# EAGLE design switch_eval_box_redo_v2-1 (EAGLE 9.6.2)
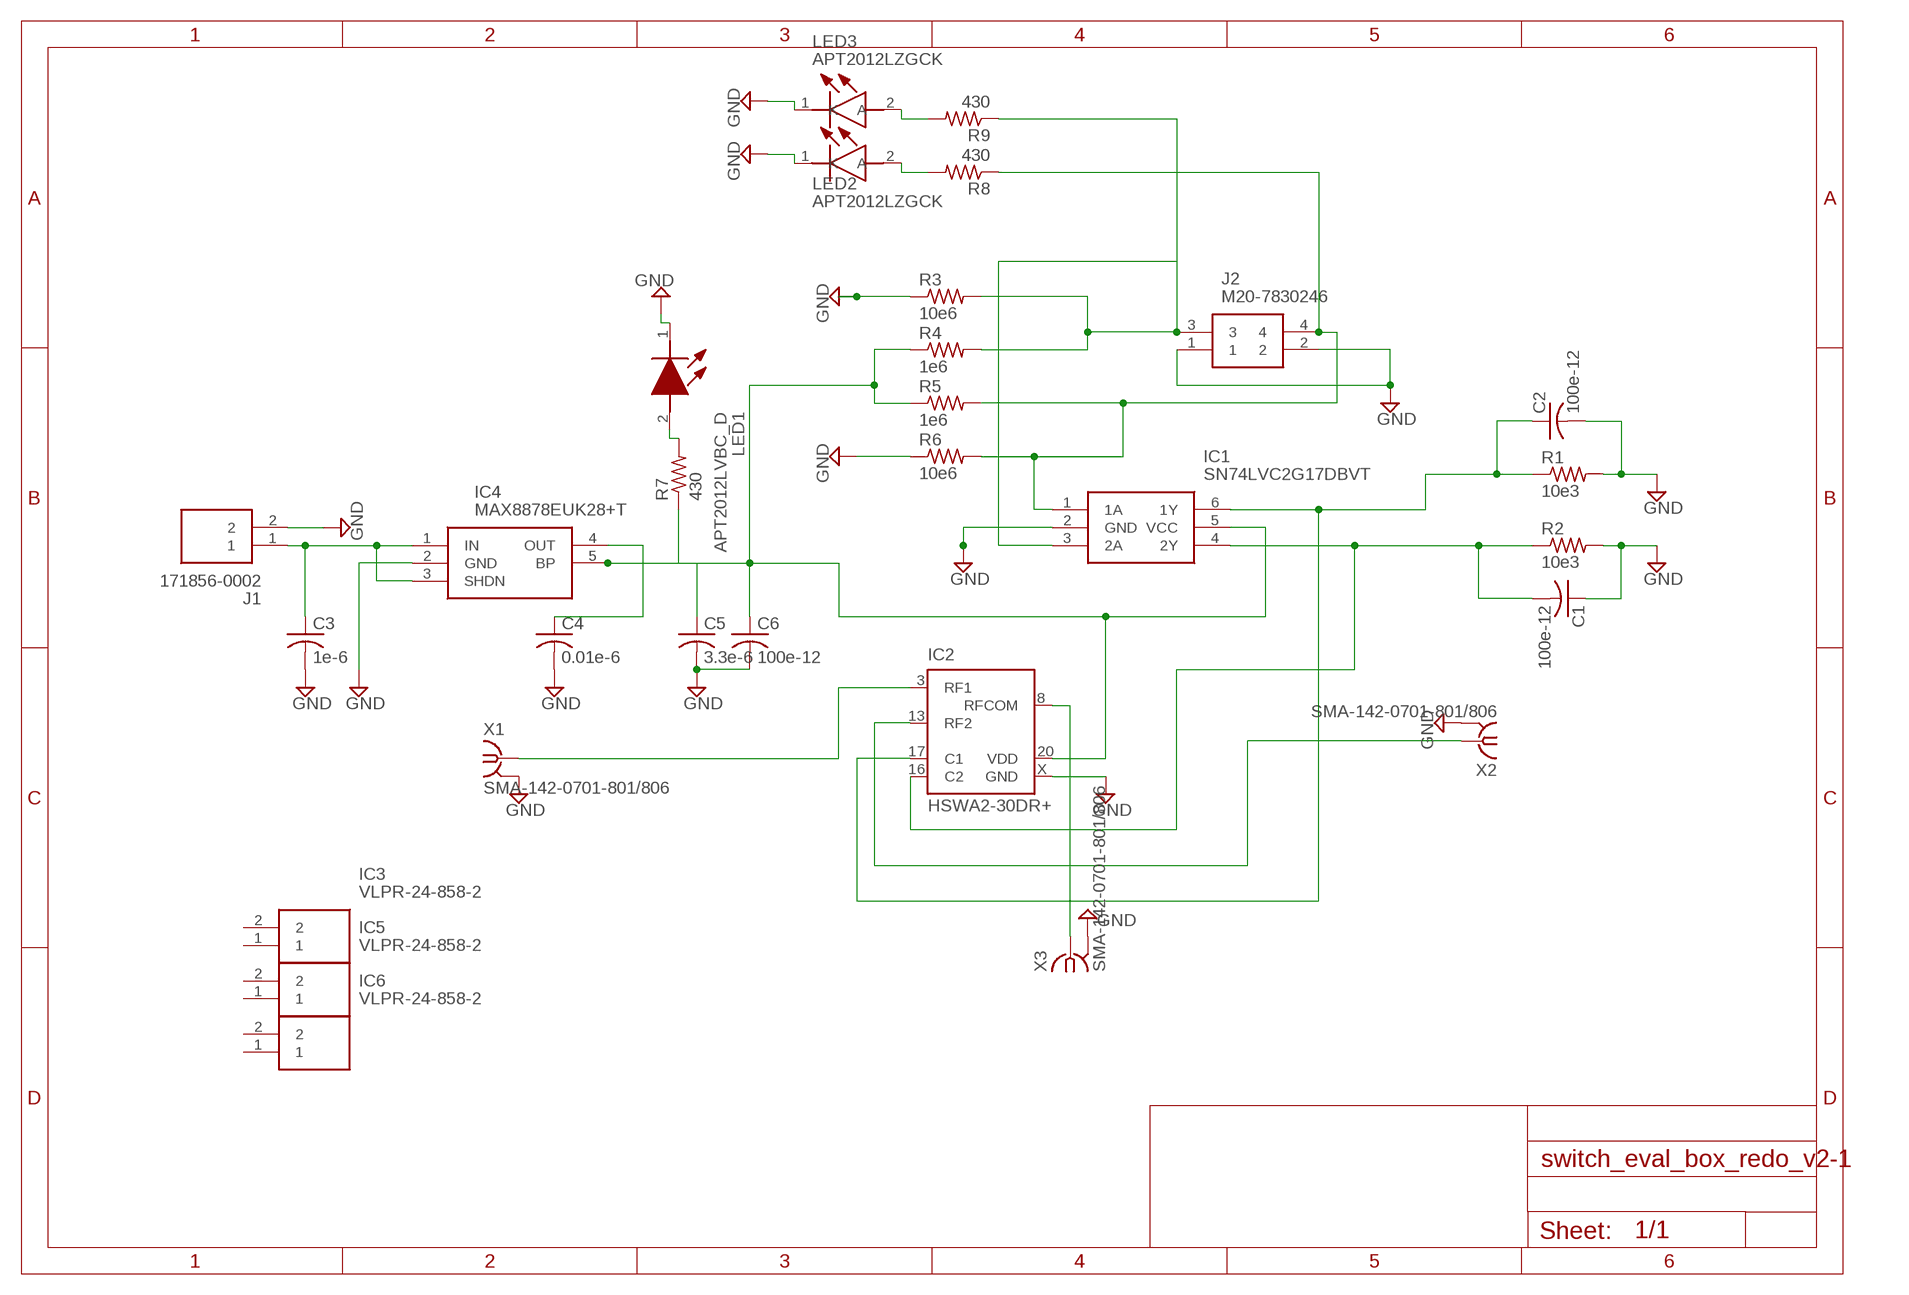
[diagram p0: schematic, sheet 1]

## Parts
C1  100e-12  C-USC0603  [C0603]
C2  100e-12  C-USC0603  [C0603]
C3  1e-6  C-USC0603  [C0603]
C4  0.01e-6  C-USC0603  [C0603]
C5  3.3e-6  C-USC0603  [C0603]
C6  100e-12  C-USC0603  [C0603]
IC1  SN74LVC2G17DBVT  [SOT95P280X145-6N]
IC2  HSWA2-30DR+  [DG983-1]
IC3  VLPR-24-858-2  [VLPR248582]
IC4  MAX8878EUK28+T  [SOT95P280X145-5N]
IC5  VLPR-24-858-2  [VLPR248582]
IC6  VLPR-24-858-2  [VLPR248582]
J1  171856-0002  [SHDR2W90P0X254_1X2_493X635X106]
J2  M20-7830246  [M207830246]
LED1  APT2012LVBC_D  [LEDC2012X85N]
LED2  APT2012LZGCK  [LEDC2012X85N]
LED3  APT2012LZGCK  [LEDC2012X85N]
R1  10e3  R-US_R0603  [R0603]
R2  10e3  R-US_R0603  [R0603]
R3  10e6  R-US_R0603  [R0603]
R4  1e6  R-US_R0603  [R0603]
R5  1e6  R-US_R0603  [R0603]
R6  10e6  R-US_R0603  [R0603]
R7  430  R-US_R0603  [R0603]
R8  430  R-US_R0603  [R0603]
R9  430  R-US_R0603  [R0603]
X1  SMA-142-0701-801/806  [J502-ND-142-0701-801/806]
X2  SMA-142-0701-801/806  [J502-ND-142-0701-801/806]
X3  SMA-142-0701-801/806  [J502-ND-142-0701-801/806]

## Nets
GND: C1.1 C2.2 C3.2 C4.2 C5.2 C6.2 IC1.2(GND) IC2.X(GND) IC4.2(GND) J1.2 J2.1 J2.2 LED1.1(K) LED2.1(K) LED3.1(K) R1.2 R2.2 R3.1 R6.1 X1.G@1 X1.G@2 X1.G@3 X1.G@4 X2.G@1 X2.G@2 X2.G@3 X2.G@4 X3.G@1 X3.G@2 X3.G@3 X3.G@4
N$1: IC1.3(2A) J2.3 R3.2 R4.2 R9.1
N$2: C3.1 IC4.1(IN) IC4.3(SHDN) J1.1
N$3: C4.1 IC4.4(OUT)
N$4: IC1.1(1A) J2.4 R5.2 R6.2 R8.1
N$5: LED1.2(A) R7.2
N$6: LED3.2(A) R9.2
N$7: C5.1 C6.1 IC1.5(VCC) IC2.20(VDD) IC4.5(BP) R4.1 R5.1 R7.1
N$8: IC2.3(RF1) X1.1
N$9: C2.1 IC1.6(1Y) IC2.17(C1) R1.1
N$10: IC2.13(RF2) X2.1
N$11: C1.2 IC1.4(2Y) IC2.16(C2) R2.1
N$12: IC2.8(RFCOM) X3.1
N$13: LED2.2(A) R8.2
Unconnected: IC3.1 IC3.2 IC5.1 IC5.2 IC6.1 IC6.2

## Power pins joined to a net without a drawn wire
GND: IC2.1(GND) IC2.2(GND) IC2.4(GND) IC2.5(GND) IC2.6(GND) IC2.7(GND) IC2.9(GND) IC2.10(GND) IC2.11(GND) IC2.12(GND) IC2.14(GND) IC2.15(GND) IC2.18(GND) IC2.19(GND)

## Library data of the parts
C1-C6 = rcl:C-US: CAPACITOR, American symbol; SPICEPREFIX: C
IC1 = SN74LVC2G17DBVT:SN74LVC2G17DBVT: DUAL SCHMITT-TRIGGER BUFFER Source: Datasheet <http://www.ti.com/lit/gpn/SN74LVC2G17>; DESCRIPTION: DUAL SCHMITT-TRIGGER BUFFER; HEIGHT: 1.45mm; MANUFACTURER_NAME: Texas Instruments; MANUFACTURER_PART_NUMBER: SN74LVC2G17DBVT; MOUSER_PART_NUMBER: 595-SN74LVC2G17DBVT; MOUSER_PRICE-STOCK: https://www.mouser.com/Search/Refine.aspx?Keyword=595-SN74LVC2G17DBVT; RS_PART_NUMBER: 6628944P; RS_PRICE-STOCK: http://uk.rs-online.com/web/p/products/6628944P
IC2 = minicircuits:HSWA2-30DR+: SPDT RF SWITCH Absorptive RF Switch with internal driver Source: http://www.minicircuits.com .. HSWA2-30DR+.pdf; OC_FARNELL: unknown; OC_NEWARK: unknown
IC3 IC5 IC6 = VLPR-24-858-2:VLPR-24-858-2: LED Light Pipes Light Pipe Vert SMD Rect Face Source: Datasheet <http://uk.rs-online.com/web/p/products/9063748>; DESCRIPTION: LED Light Pipes Light Pipe Vert SMD Rect Face; HEIGHT: 21mm; MANUFACTURER_NAME: Bivar; MANUFACTURER_PART_NUMBER: VLPR-24-858-2; RS_PART_NUMBER: 9063748; RS_PRICE-STOCK: http://uk.rs-online.com/web/p/products/9063748
IC4 = MAX8878EUK28+T:MAX8878EUK28+T: LDO Voltage Regulators Low-Noise, Low-Dropout, 150mA Linear Regulators with 2982 Pinout Source: Datasheet <https://www.mouser.com/datasheet/2/256/MAX8878-1389229.pdf>; DESCRIPTION: LDO Voltage Regulators Low-Noise, Low-Dropout, 150mA Linear Regulators with 2982 Pinout; HEIGHT: 1.45mm; MANUFACTURER_NAME: Maxim Integrated; MANUFACTURER_PART_NUMBER: MAX8878EUK28+T
J1 = 171856-0002:171856-0002: KK 254 RPC Pin Header friction lock 2way Molex KK 254 Series, Series Number 171856, 2.54mm Pitch 2 Way 1 Row Straight PCB Header, Through Hole Source: Datasheet <https://www.digikey.com/product-detail/en/molex/1718560002/WM10153-ND/4423109>; ALLIED_NUMBER: 70314268; ALLIED_PRICE-STOCK: https://www.alliedelec.com/molexincorporated-171856-0002/70314268/; DESCRIPTION: KK 254 RPC Pin Header friction lock 2way Molex KK 254 Series, Series Number 171856, 2.54mm Pitch 2 Way 1 Row Straight PCB Header, Through Hole; HEIGHT: 10.61mm; MANUFACTURER_NAME: Molex; MANUFACTURER_PART_NUMBER: 171856-0002; MOUSER_PART_NUMBER: 538-171856-0002; MOUSER_PRICE-STOCK: https://www.mouser.com/Search/Refine.aspx?Keyword=538-171856-0002; RS_PART_NUMBER: 7922884P; RS_PRICE-STOCK: http://uk.rs-online.com/web/p/products/7922884P
J2 = M20-7830246:M20-7830246: HARWIN 2.54mm 4 Way 2 Row Straight PCB Socket Through Hole Socket Strip Source: Datasheet <https://cdn.harwin.com/pdfs/M20-783.pdf>; ALLIED_NUMBER: R1052762; ALLIED_PRICE-STOCK: https://www.alliedelec.com/harwin-m20-7830246/R1052762/; DESCRIPTION: HARWIN 2.54mm 4 Way 2 Row Straight PCB Socket Through Hole Socket Strip; HEIGHT: 8.65mm; MANUFACTURER_NAME: HARWIN; MANUFACTURER_PART_NUMBER: M20-7830246; MOUSER_PART_NUMBER: 855-M20-7830246; MOUSER_PRICE-STOCK: https://www.mouser.com/Search/Refine.aspx?Keyword=855-M20-7830246; RS_PART_NUMBER: 6816839P; RS_PRICE-STOCK: http://uk.rs-online.com/web/p/products/6816839P
LED1 = APT2012LVBC_D:APT2012LVBC_D: Standard LEDs - SMD 2.0X1.2MM LOW CRNT Source: Datasheet <https://componentsearchengine.com/Datasheets/1/APT2012LVBC_D.pdf>; ARROW_PART_NUMBER: APT2012LVBC/D; ARROW_PRICE-STOCK: https://www.arrow.com/en/products/apt2012lvbcd/kingbright; DESCRIPTION: Standard LEDs - SMD 2.0X1.2MM LOW CRNT; HEIGHT: 0.85mm; MANUFACTURER_NAME: Kingbright; MANUFACTURER_PART_NUMBER: APT2012LVBC/D; MOUSER_PART_NUMBER: 604-APT2012LVBCD; MOUSER_PRICE-STOCK: https://www.mouser.co.uk/ProductDetail/Kingbright/APT2012LVBC-D?qs=6oMev5NRZMGErJYT6KZLXg%3D%3D
LED2 LED3 = APT2012LZGCK:APT2012LZGCK: Standard LEDs - SMD 2.0X1.2MM LOW CRNT Source: Datasheet <http://www.kingbrightusa.com/images/catalog/SPEC/APT2012LZGCK.pdf>; ALLIED_NUMBER: 71056205; ALLIED_PRICE-STOCK: https://www.alliedelec.com/kingbright-apt2012lzgck/71056205/; DESCRIPTION: Standard LEDs - SMD 2.0X1.2MM LOW CRNT; HEIGHT: 0.85mm; MANUFACTURER_NAME: Kingbright; MANUFACTURER_PART_NUMBER: APT2012LZGCK; MOUSER_PART_NUMBER: 604-APT2012LZGCK; MOUSER_PRICE-STOCK: https://www.mouser.com/Search/Refine.aspx?Keyword=604-APT2012LZGCK
R1-R9 = rcl:R-US_: RESISTOR, American symbol; SPICEPREFIX: R
X1-X3 = con-coax:SMA-: SMA 50 Ohm End Launch Jack Receptacle - Round Contact Johnson Components Source: www.johnsoncomponents.com .. J502-ND.pdf; MF: JOHNSON COMPONENTS; MPN: 142-0701-801; OC_FARNELL: 1608592; OC_NEWARK: 90F2624

## Board
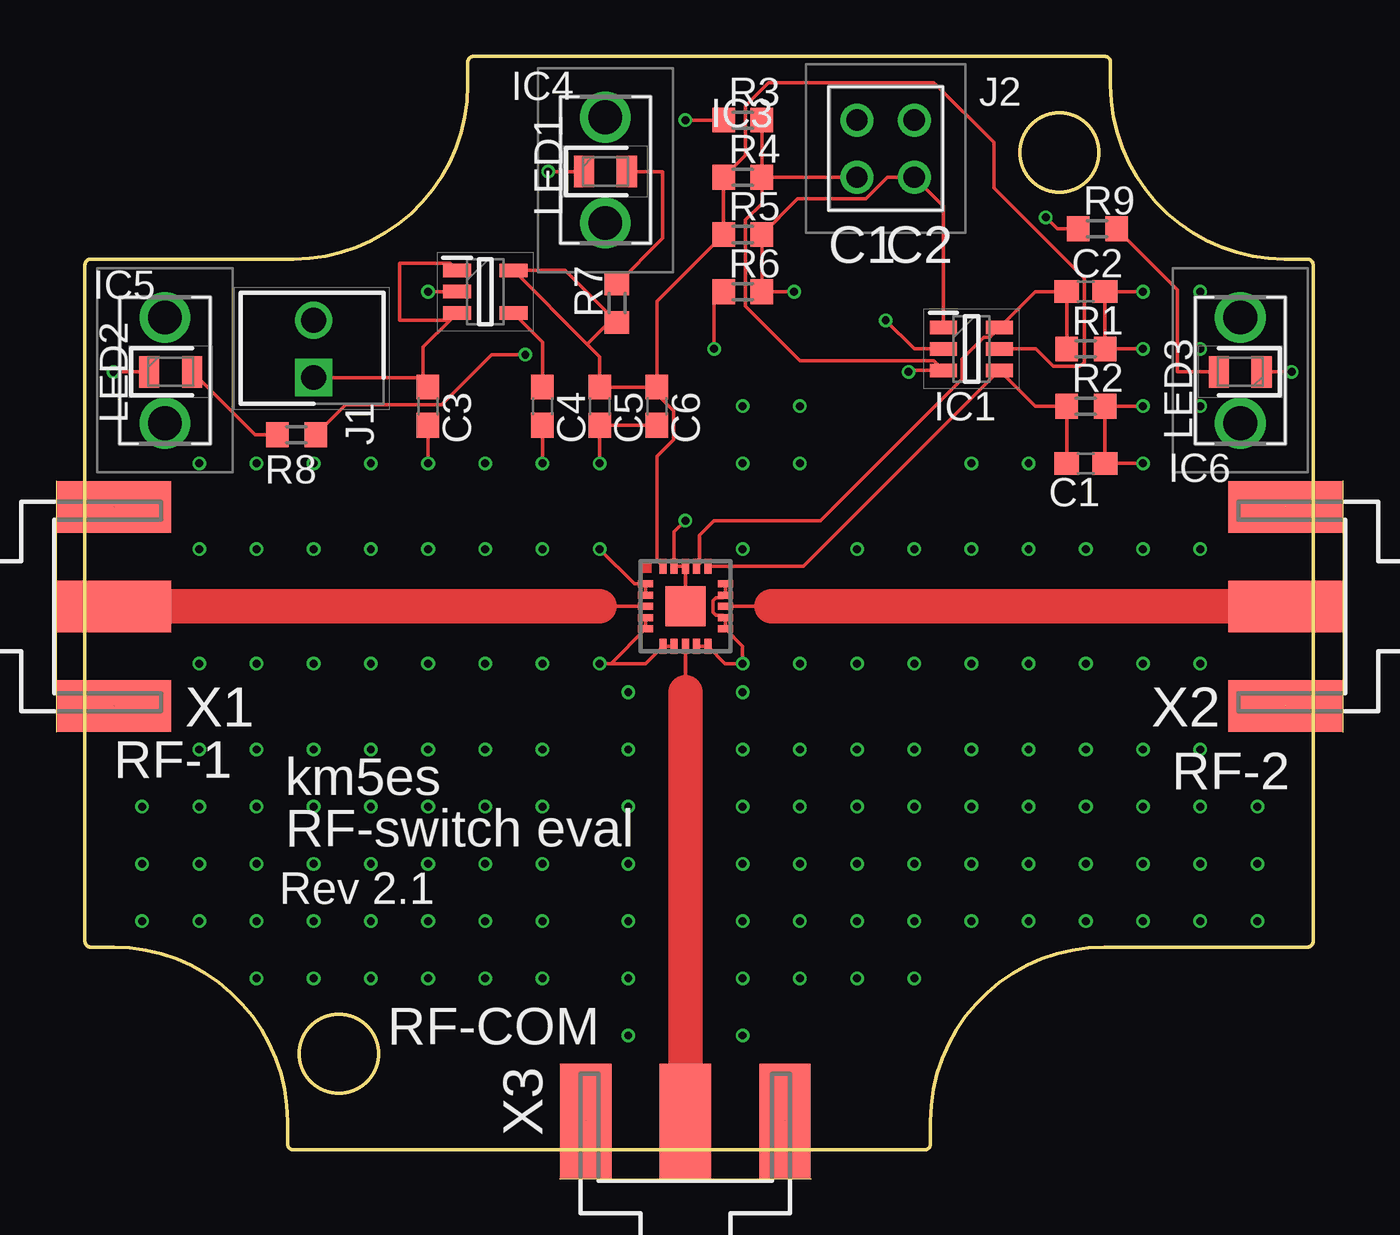
[diagram p1: board, top side]
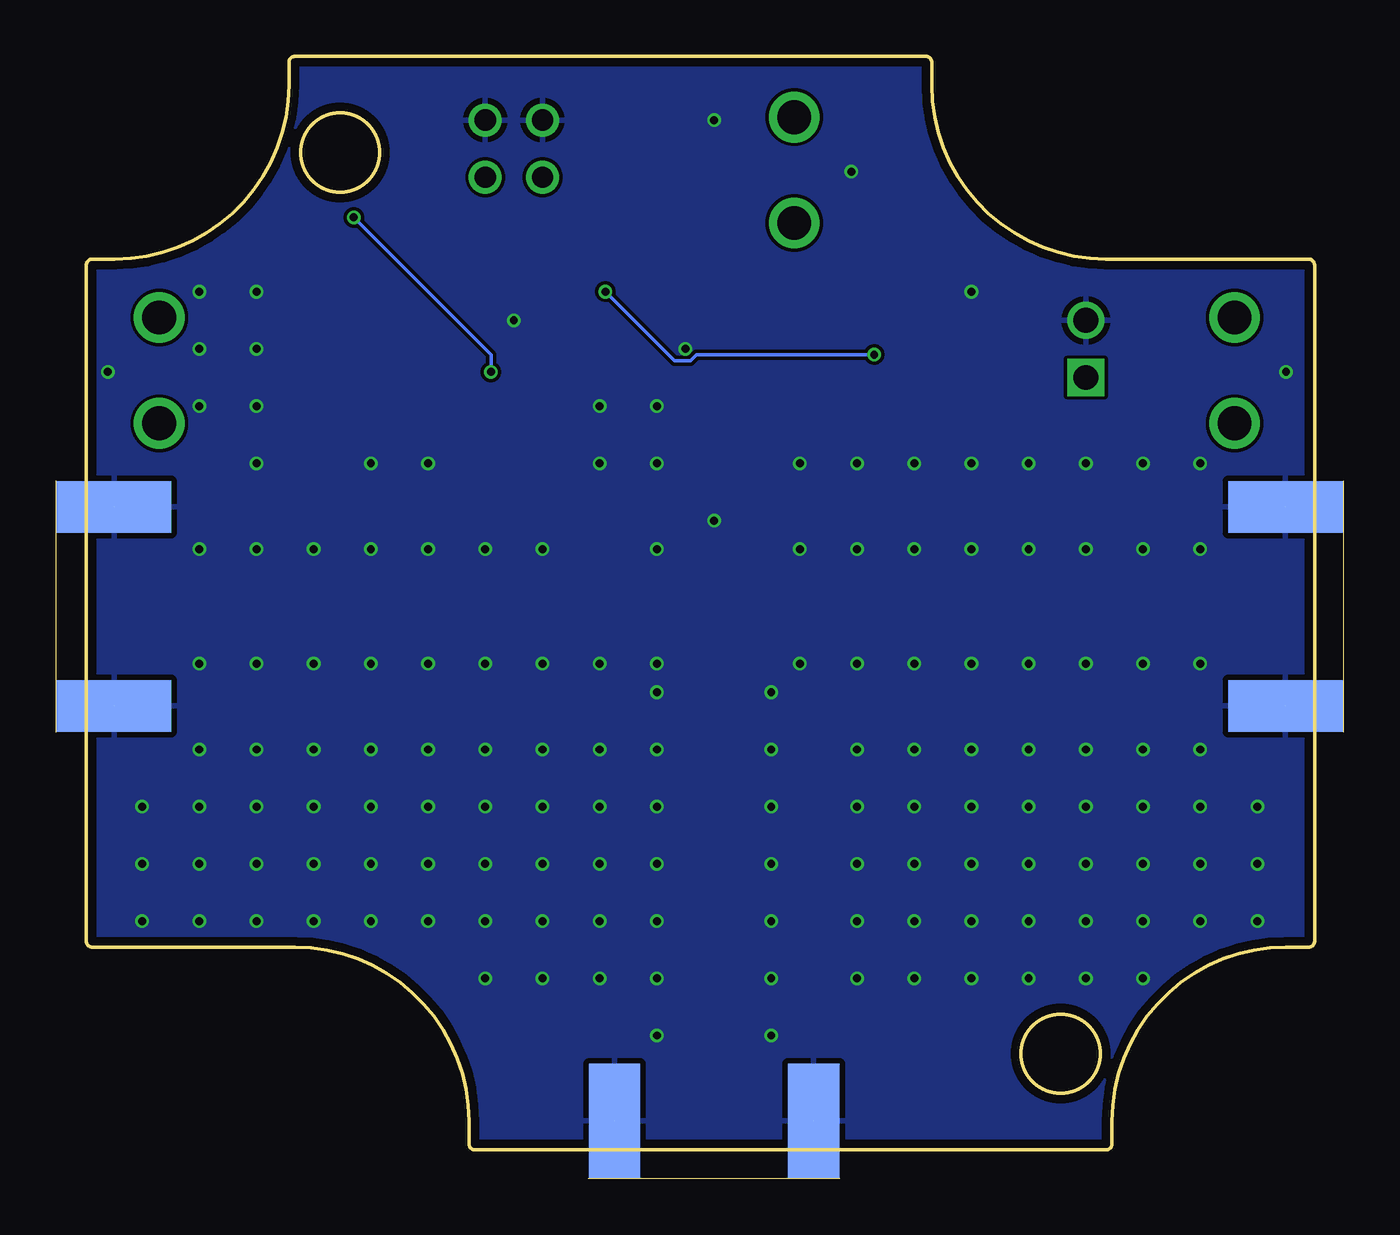
[diagram p2: board, bottom side, seen from below]

Size 54.55 x 48.55 mm. Coordinates in mm from the lower left corner, seen from the top.
Outline: 45.55,47.27 45.55,48.27 arc90 45.27,48.55 17.27,48.55 arc90 17,48.27 17,47.27 arc-90 9.28,39.55 0.28,39.55 arc90 0,39.27 0,9.28 arc90 0.28,9 1.27,9 arc-90 9,1.27 9,0.28 arc90 9.28,0 37.27,0 arc90 37.55,0.28 37.55,1.27 arc-90 45.27,9 54.27,9 arc90 54.55,9.28 54.55,39.27 arc90 54.27,39.55 53.27,39.55 arc-90 45.55,47.27
Outline: circle at 43.28,44.28 radius 1.75
Outline: circle at 11.28,4.28 radius 1.75
Copper layers (1*16): Top 0.035559375mm / dielectric 1.6mm / Bottom 0.035559375mm
Design rules "oshpark-2layer": minimum track width 6mil, minimum drill 10mil, track to track 6mil, track to pad 6mil, pad to pad 6mil, via to via 6mil, smd to smd 6mil, copper to edge 15mil, drill to drill 6mil, minimum pad ring 5mil, minimum via ring 5mil, stop-mask expansion 2.5mil, vias tented up to drill 0mil, thermal gap 10mil

### Footprints (pad centres in the part's own frame; a part is rotated, then mirrored left to right if it is on the bottom)
C0603 = smd 1.1 x 1: 1 -0.85,0; 2 0.85,0
SOT95P280X145-6N = smd 1.2 x 0.6: 1 -1.25,0.95; 2 -1.25,0; 3 -1.25,-0.95; 4 1.25,-0.95; 5 1.25,0; 6 1.25,0.95
DG983-1 = smd 0.66 x 0.31: 1 -1.775,1; 2 -1.775,0.5; 3 -1.775,0; 4 -1.775,-0.5; 5 -1.775,-1; 11 1.775,-1; 12 1.775,-0.5; 13 1.775,0; 14 1.775,0.5; 15 1.775,1 | smd 0.31 x 0.66: 6 -1,-1.775; 7 -0.5,-1.775; 8 0,-1.775; 9 0.5,-1.775; 10 1,-1.775; 16 1,1.775; 17 0.5,1.775; 18 0,1.775; 19 -0.5,1.775; 20 -1,1.775 | smd 1.78 x 1.78: X 0,0
VLPR248582 = drill 1.5 pad 2.25: 1 0,0; 2 0,4.7
SOT95P280X145-5N = smd 1.25 x 0.6: 1 -1.25,0.95; 2 -1.25,0; 3 -1.25,-0.95; 4 1.25,-0.95; 5 1.25,0.95
SHDR2W90P0X254_1X2_493X635X106 = drill 1.1 pad 1.65 square: 1 0,0 | drill 1.1 pad 1.65: 2 2.54,0
M207830246 = drill 0.94 pad 1.462: 1 -1.27,-1.27; 2 -1.27,1.27; 3 1.27,-1.27; 4 1.27,1.27
LEDC2012X85N = smd 0.9 x 1.4: 1 -0.95,0; 2 0.95,0
R0603 = smd 1 x 1.1: 1 -0.85,0; 2 0.85,0
J502-ND-142-0701-801/806 = smd 5.08 x 2.286: 1 2.565,0; G@1 2.565,4.42; G@2 2.565,-4.42 | smd 5.08 x 2.286 bottom: G@3 2.565,4.42; G@4 2.565,-4.42

### Placement (x,y rotation side)
C1  44.45,30.48 180 top
C2  44.45,38.1 0 top
C3  15.24,33.02 270 top
C4  20.32,33.02 270 top
C5  22.86,33.02 270 top
C6  25.4,33.02 270 top
IC1  39.37,35.56 0 top
IC2  26.67,24.13 0 top
IC3  23.11,41.15 0 top
IC4  17.78,38.1 0 top
IC5  3.56,32.26 0 top
IC6  51.31,32.26 0 top
J1  10.16,34.29 90 top
J2  35.56,44.45 270 top
LED1  23.11,43.43 0 top
LED2  3.81,34.54 0 top
LED3  51.31,34.54 180 top
R1  44.45,35.56 0 top
R2  44.45,33.02 0 top
R3  29.21,45.72 0 top
R4  29.21,43.18 0 top
R5  29.21,40.64 0 top
R6  29.21,38.1 0 top
R7  23.62,37.59 90 top
R8  9.4,31.75 180 top
R9  44.96,40.89 0 top
X1  -1.27,24.13 0 top
X2  55.88,24.13 180 top
X3  26.67,-1.27 90 top

### Tracks (layer width: path | path; a pad name or v marks a point on that pad's centre or on a via)
GND  (via drill 0.35)  (6 unrouted)
  Top 0.152: R3.1 v26.67,45.72 | C3.2 v15.24,30.48 | IC4.2 v15.24,38.1 | C4.2 v20.32,30.48 | C5.2 22.86,31.75 | 22.86,31.75 v22.86,30.48 | R6.1 27.94,37.68 v27.94,35.56 | IC1.2 36.83,35.56 v35.56,36.83 | v46.99,35.56 R1.2 C2.2 v46.99,38.1 | v46.99,33.02 R2.2 C1.1 v46.99,30.48 | IC2.9 IC2.10 28.43,21.59 v29.21,21.59 29.21,22.36 IC2.11 IC2.12 28.33,23.75 28.02,23.75 27.89,23.88 27.89,24.38 28.02,24.51 28.33,24.51 IC2.14 IC2.15 | IC2.7 IC2.6 24.91,21.59 23.36,21.59 | IC2.4 IC2.5 23.36,21.59 | IC2.2 IC2.1 24.4,25.13 v22.86,26.67 | v26.67,27.94 26.17,27.44 IC2.19 IC2.18 IC2.X | 23.36,21.59 v22.86,21.59 | C6.2 23.28,32.17 22.86,31.75 | LED1.1 v20.57,43.43 | LED3.1 v53.59,34.54 | LED2.1 v1.27,34.54
  other vias: 20.32,26.67 17.78,26.67 15.24,26.67 12.7,26.67 10.16,26.67 7.62,26.67 5.08,26.67 5.08,21.59 7.62,21.59 10.16,21.59 12.7,21.59 15.24,21.59 17.78,21.59 20.32,21.59 31.75,21.59 34.29,21.59 36.83,21.59 39.37,21.59 41.91,21.59 44.45,21.59 46.99,21.59 49.53,21.59 34.29,26.67 36.83,26.67 39.37,26.67 41.91,26.67 44.45,26.67 46.99,26.67 49.53,26.67 29.21,26.67 24.13,20.32 24.13,17.78 24.13,15.24 24.13,12.7 24.13,10.16 24.13,7.62 29.21,20.32 29.21,17.78 29.21,15.24 29.21,12.7 29.21,10.16 29.21,7.62 5.08,17.78 7.62,17.78 10.16,17.78 12.7,17.78 15.24,17.78 17.78,17.78 20.32,17.78 20.32,15.24 10.16,10.16 2.54,15.24 5.08,15.24 7.62,15.24 10.16,15.24 12.7,15.24 15.24,15.24 17.78,15.24 20.32,12.7 20.32,10.16 24.13,5.08 20.32,7.62 15.24,7.62 17.78,10.16 17.78,7.62 17.78,12.7 15.24,12.7 12.7,12.7 12.7,10.16 12.7,7.62 10.16,7.62 7.62,7.62 7.62,10.16 7.62,12.7 5.08,12.7 5.08,10.16 2.54,10.16 2.54,12.7 10.16,12.7 15.24,10.16 29.21,5.08 31.75,7.62 34.29,7.62 36.83,7.62 34.29,10.16 31.75,10.16 36.83,10.16 39.37,10.16 31.75,12.7 31.75,15.24 31.75,17.78 34.29,17.78 34.29,15.24 34.29,12.7 36.83,12.7 39.37,12.7 39.37,15.24 36.83,15.24 36.83,17.78 39.37,17.78 41.91,17.78 41.91,15.24 41.91,12.7 41.91,10.16 44.45,10.16 44.45,12.7 44.45,15.24 44.45,17.78 46.99,17.78 46.99,15.24 49.53,15.24 49.53,17.78 52.07,15.24 52.07,12.7 49.53,12.7 46.99,12.7 46.99,10.16 49.53,10.16 52.07,10.16 5.08,30.48 7.62,30.48 10.16,30.48 12.7,30.48 17.78,30.48 29.21,30.48 29.21,33.02 31.75,33.02 31.75,30.48 39.37,30.48 41.91,30.48 49.53,33.02 49.53,35.56 49.53,38.1
  pour Bottom: 8.89,0 38.1,0 38.1,3.81 43.18,8.89 54.61,8.89 54.61,39.37 53.34,40.64 49.53,40.64 45.72,44.45 45.72,48.26 16.51,48.26 16.51,45.72 10.16,39.37 0,39.37 0,8.89 2.54,8.89 8.89,2.54
N$1  (via drill 0.35)
  Top 0.152: R3.2 R4.2 | J2.3 R4.2 | R4.2 30.06,42.01 29.33,41.28 29.33,37.45 31.75,35.03 37.7,35.03 IC1.3 36.64,34.61 v36.58,34.54 | R9.1 43.18,40.89 v42.67,41.4
  Bottom 0.152: v42.67,41.4 36.58,35.31 v36.58,34.54
N$2
  Top 0.152: J1.1 14.82,34.29 15.03,34.08 | 15.03,34.08 C3.1 | IC4.3 16.36,36.98 16.21,36.83 | 16.21,36.83 15.03,35.65 15.03,34.08 | IC4.1 16.21,39.37 13.97,39.37 13.97,36.83 16.21,36.83
N$3
  Top 0.152: IC4.4 20.32,35.86 C4.1
N$4  (via drill 0.35)
  Top 0.152: IC1.1 38.12,41.89 J2.4 35.65,43.18 34.69,42.22 31.64,42.22 R5.2 R6.2 v31.5,38.1 | R8.1 11.59,33.09 15.84,33.09 18.05,35.31 v19.56,35.31
  Bottom 0.152: v19.56,35.31 27.44,35.31 27.72,35.03 28.43,35.03 v31.5,38.1
N$5
  Top 0.152: R7.2 25.65,40.47 25.65,43.43 LED1.2
N$6
  Top 0.152: R9.2 48.51,38.19 48.51,34.54 LED3.2
N$7
  Top 0.152: 22.31,35.77 IC4.5 21.31,39.05 R7.1 23.28,36.74 22.31,35.77 | 22.31,35.77 22.86,35.22 C5.1 C6.1 | C6.1 25.4,37.68 R5.1 R4.1 29.33,44.15 29.33,46.37 30.35,47.38 37.71,47.38 40.36,44.73 40.36,42.72 44.38,38.7 44.38,34.97 44.2,34.78 43.01,34.78 42.23,35.56 IC1.5 | IC2.20 25.4,26.18 25.4,30.8 26.13,31.52 26.13,32.81 25.4,33.54 C6.1
N$8
  Top 0.152: 22.86,24.13 IC2.3
  Top 1.524: X1.1 22.86,24.13
N$9
  Top 0.152: R1.1 C2.1 42.21,38.1 IC1.6 40.2,36.09 39.92,36.09 38.95,35.11 38.95,34.22 32.67,27.94 27.94,27.94 27.29,27.29 27.29,26.02 IC2.17
N$10
  Top 0.152: 30.48,24.13 IC2.13
  Top 1.524: X2.1 30.48,24.13
N$11
  Top 0.152: C1.2 R2.1 42.21,33.02 IC1.4 31.91,25.91 IC2.16
N$12
  Top 0.152: 26.67,20.32 IC2.8
  Top 1.524: X3.1 26.67,20.32
N$13
  Top 0.152: R8.2 7.55,31.75 LED2.2

### Text on the board
tNames: C1 | C2 | RF-1 | km5es | RF-2 | RF-switch eval | Rev 2.1 | RF-COM